# Altium schematic sheet buzzer.SchDoc
size A4
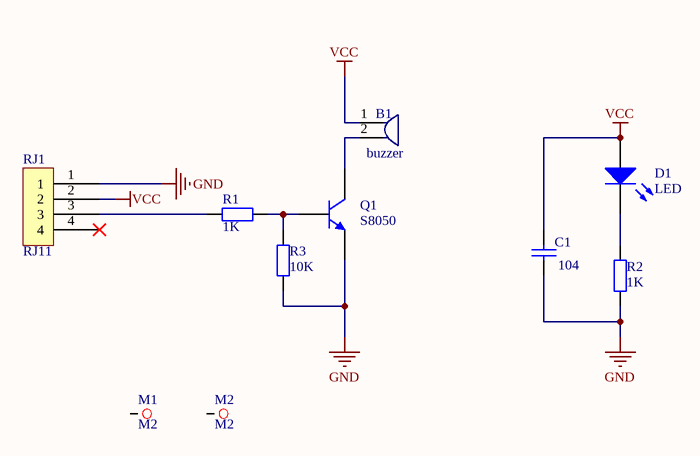
[diagram p0: buzzer.SchDoc]

## Parts
B1  buzzer  [BUZZER]
C1  value 104  [0603_C]  (hidden comment: Cap)
D1  LED  [0805]
M1  M2  [M2]
M2  M2  [M2]
Q1  S8050  [SOT23]
R1  value 1K  [0603_R]  (hidden comment: Res2)
R2  value 1K  [0603_R]  (hidden comment: Res2)
R3  value 10K  [0603_R]  (hidden comment: Res2)
RJ1  RJ11  [RJ11]

## Nets
GND: C1.1 Q1.1(E) R2.1 R3.2 RJ1.1
VCC: B1.1 C1.2 D1.1(A) RJ1.2
NetB1_2: B1.2 Q1.3(C)
NetD1_2: D1.2(K) R2.2
NetQ1_2: Q1.2(B) R1.1 R3.1
NetR1_2: R1.2 RJ1.3

Not connected (* = marked no-connect by the designer): M1 0; M2 0; RJ1 4*

## Library data of the parts
C1 = Cap: Capacitor; Published: 8-Jun-2000; LatestRevisionDate: 17-Jul-2002; LatestRevisionNote: Re-released for DXP Platform.; PackageReference: RAD-0.3; Publisher: Altium Limited
D1 = LED1: Typical RED GaAs LED; Published: 8-Jun-2000; LatestRevisionDate: 08-Jul-2005; LatestRevisionNote: Mech Layer 1 removed.; PackageReference: LED-1; Publisher: Altium Limited
M1 M2 = M3
Q1 = 2N3904: NPN General Purpose Amplifier; Published: 8-Jun-2000; LatestRevisionDate: 15-Jan-2003; LatestRevisionNote: PCB Footprint 'BCY-W3/D4.7' replaced; DatasheetVersion: 1997; PackageVersion: Sep-1998; PackageReference: TO-92A; Publisher: Altium Limited; Code_JEDEC: TO-92A; ComponentLink1Description: Manufacturer Link; ComponentLink1URL: http://www.fairchildsemi.com/; ComponentLink2Description: Datasheet; ComponentLink2URL: http://www.fairchildsemi.com/ds/2N%2F2N3904.pdf
R1-R3 = Res2: Resistor; Published: 8-Jun-2000; LatestRevisionDate: 17-Jul-2002; LatestRevisionNote: Re-released for DXP Platform.; PackageReference: AXIAL-0.4; Publisher: Altium Limited